# Altium project MB1272.PrjPcb (part 5 of 5)

## Sheet AUDIO.SchDoc: AUDIO
size A4; Project: STM32MP15-DISCO PI; Date: Not used; ApprovedBy: Not used; CheckedBy: Not used; Author: Not used; CompanyName: STMicroelectronics; DrawnBy: Not used; Engineer: Not used; Organization: Not used; Address1: Not used; Address2: Not used; Address3: Not used; Address4: Not used; DocumentNumber: 6; Revision: Not used; SheetNumber: 7; SheetTotal: 15; CurrentTime: Not used; CurrentDate: Not used; Time: Not used; DocumentFullPathAndName: Not used; DocumentName: Not used; ModifiedDate: Not used; ImagePath: Not used; ProjectName: Not used; Application_BuildNumber: Not used
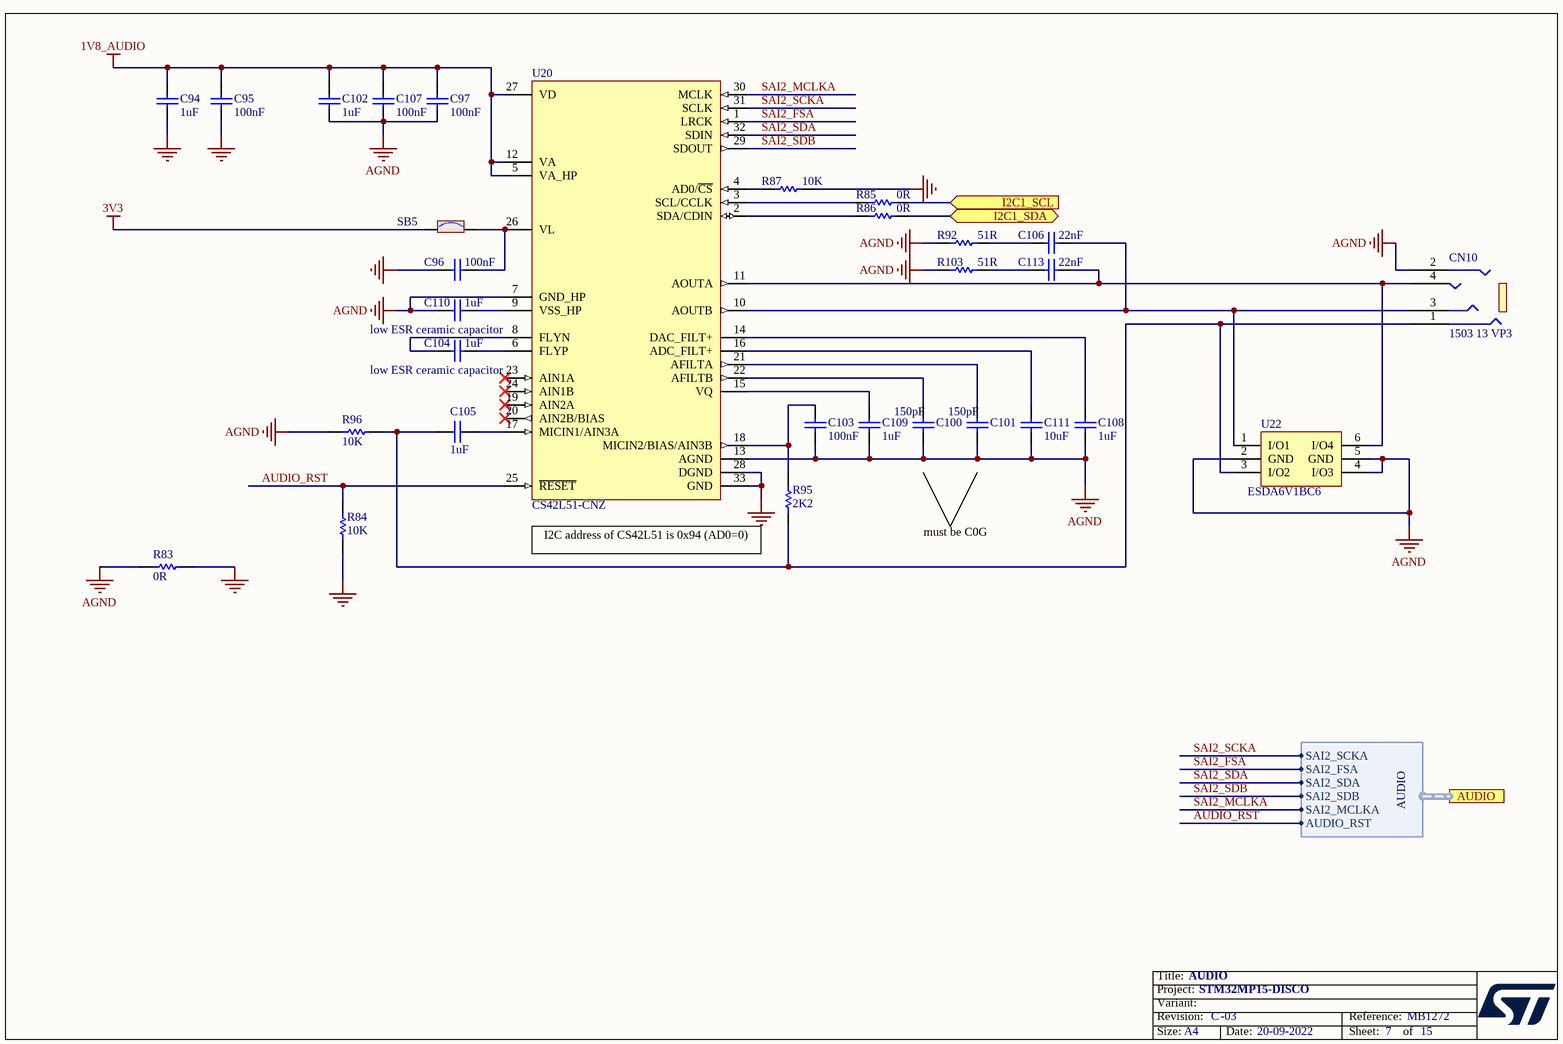
[diagram p13: AUDIO.SchDoc]

### Parts
C94  value 1uF  [C0402]
C95  value 100nF  [C0402]
C96  value 100nF  [C0402]
C97  value 100nF  [C0402]
C100  value 150pF  [C0603]
C101  value 150pF  [C0603]
C102  value 1uF  [C0402]
C103  value 100nF  [C0402]
C104  value 1uF  [C0603]
C105  value 1uF  [C0402]
C106  value 22nF  [C0402]
C107  value 100nF  [C0402]
C108  value 1uF  [C0402]
C109  value 1uF  [C0402]
C110  value 1uF  [C0603]
C111  value 10uF  [C0603]
C113  value 22nF  [C0402]
CN10  value 1503 13 VP3  [CON_JACK-3P5-SMT_LUMBERG_1503-13-VP3]
R83  value 0R  [R0603]
R84  value 10K  [R0402]
R85  value 0R  [R0402]
R86  value 0R  [R0402]
R87  value 10K  [R0402]
R92  value 51R  [R0402]
R95  value 2K2  [R0402]
R96  value 10K  [R0402]
R103  value 51R  [R0402]
SB5  (no value)  [SOLDER-BRIDGE_R0603-0R]
U20  value CS42L51-CNZ  [ICC_QFN32-EPAD_5X5_P050]
U22  value ESDA6V1BC6  [ESD_SOT23-6L]

### Ports
AUDIO (harness AUDIO), I2C1_SCL (in), I2C1_SDA (bidir)

### Harnesses
AUDIO: SAI2_SCKA, SAI2_FSA, SAI2_SDA, SAI2_SDB, SAI2_MCLKA, AUDIO_RST

### Nets
1V8_AUDIO: C94.2 C95.2 C97.2 C102.2 C107.2 U20.5(VA_HP) U20.12(VA) U20.27(VD)
3V3: SB5.1
AGND: C97.1 C100.1 C101.1 C102.1 C103.1 C107.1 C108.1 C109.1 C110.1 C111.1 CN10.2 R83.1 R92.1 R96.1 R103.1 U20.7(GND_HP) U20.13(AGND) U22.2(GND) U22.4(I/O3) U22.5(GND)
GND: C94.1 C95.1 C96.2 R83.2 R84.1 R87.2 U20.28(DGND) U20.33(GND)
AUDIO_RST: R84.2 U20.25(~{RESET}) ; port AUDIO.AUDIO_RST
I2C1_SCL: R85.2 ; port I2C1_SCL
I2C1_SDA: R86.2 ; port I2C1_SDA
SAI2_FSA: U20.1(LRCK) ; port AUDIO.SAI2_FSA
SAI2_MCLKA: U20.30(MCLK) ; port AUDIO.SAI2_MCLKA
SAI2_SCKA: U20.31(SCLK) ; port AUDIO.SAI2_SCKA
SAI2_SDA: U20.32(SDIN) ; port AUDIO.SAI2_SDA
SAI2_SDB: U20.29(SDOUT) ; port AUDIO.SAI2_SDB
NetC96_1: C96.1 SB5.2 U20.26(VL)
NetC100_2: C100.2 U20.22(AFILTB)
NetC101_2: C101.2 U20.21(AFILTA)
NetC103_2: C103.2 R95.2 U20.18(MICIN2/BIAS/AIN3B)
NetC104_1: C104.1 U20.8(FLYN)
NetC104_2: C104.2 U20.6(FLYP)
NetC105_1: C105.1 CN10.1 R95.1 R96.2 U22.3(I/O2)
NetC105_2: C105.2 U20.17(MICIN1/AIN3A)
NetC106_1: C106.1 R92.2
NetC106_2: C106.2 CN10.3 U20.10(AOUTB) U22.1(I/O1)
NetC108_2: C108.2 U20.14(DAC_FILT+)
NetC109_2: C109.2 U20.15(VQ)
NetC110_2: C110.2 U20.9(VSS_HP)
NetC111_2: C111.2 U20.16(ADC_FILT+)
NetC113_1: C113.1 R103.2
NetC113_2: C113.2 CN10.4 U20.11(AOUTA) U22.6(I/O4)
NetR85_1: R85.1 U20.3(SCL/CCLK)
NetR86_1: R86.1 U20.2(SDA/CDIN)
NetR87_1: R87.1 U20.4(AD0/~{CS})

Not connected (* = marked no-connect by the designer): U20 19(AIN2A)* 20(AIN2B/BIAS)* 23(AIN1A)* 24(AIN1B)*

### Notes on the sheet
- low ESR ceramic capacitor
- I2C address of CS42L51 is 0x94 (AD0=0)
- must be C0G
- Title:
- Project:
- Size:
- Revision:
- Variant:
- A4
- -
- Date:
- Reference:
- Sheet:
- of

### Library data of the parts
C94 C102 C105 C108 C109 = MCD-00095: Capacitor,1uF,6V3,X5R,10%,0402; Manufacturer_Part_Number: GRM155R61E105KA12; Manufacturer: MURATA; Alternate_Manufacturer_Part_Number: GRM155R60J105KE19; ECCN_US: EAR99; ECCN_EU: NEC; Provided_By: SUBCO; Initial_Board_Reference: mb1262; Internal_Part_Number: MCD-00095; ComponentLink1Description: Datasheet; Status: Released; Part_Type: Capacitor; Package: C0402; ComponentLink1URL: http://tunmcdsvn.tun.st.com/Component_Datasheet_Library/Trunk/Capacitors/Murata_Capacitor_GR_series; Alternate_Manufacturer: MURATA
C95-C97 C103 C107 = MCD-00006: Capacitor,100nF,16V,X7R,10%,0402; Manufacturer_Part_Number: CC0402KRX7R7BB104; Manufacturer: YAGEO; Alternate_Manufacturer: MURATA; Alternate_Manufacturer_Part_Number: GCM155R71C104KA55D; Provided_By: SUBCO; Initial_Board_Reference: mb1274; Internal_Part_Number: MCD-00006; ComponentLink1Description: Datasheet; ECCN_US: n/a; ECCN_EU: n/a; Status: Released; Part_Type: Capacitor; Package: C0402; ComponentLink1URL: http://tunmcdsvn.tun.st.com/Component_Datasheet_Library/Trunk/Capacitors/Yageo_Multilayer_Capacitor_X7R_series_100pF_to_22uF
C100 C101 = MCD-00304: Capacitor,150pF,50V,COG,5%,0603; Manufacturer_Part_Number: CC0603JRNPO9BN151; Manufacturer: YAGEO; Provided_By: SUBCO; Initial_Board_Reference: mb1263; Internal_Part_Number: MCD-00304; ComponentLink1Description: Datasheet; ECCN_US: n/a; ECCN_EU: n/a; Status: Released; Part_Type: Capacitor; Package: C0603; ComponentLink1URL: http://tunmcdsvn.tun.st.com/Component_Datasheet_Library/Trunk/Capacitors/Yageo_Capacitor_NP0_16V-to-50V
C104 C110 = MCD-00010: Capacitor,1uF,16V,X5R,10%,0603; Manufacturer_Part_Number: CC0603KRX5R7BB105; Manufacturer: YAGEO; Provided_By: SUBCO; Initial_Board_Reference: mb1274; Internal_Part_Number: MCD-00010; ComponentLink1Description: Datasheet; ECCN_US: n/a; ECCN_EU: n/a; Status: Released; Part_Type: Capacitor; Package: C0603; ComponentLink1URL: http://tunmcdsvn.tun.st.com/Component_Datasheet_Library/Trunk/Capacitors/Yageo_Multilayer_capacitor_X5R_series_100pF_to_100uF
C106 C113 = MCD-00202: Capacitor,22nF,16V,X7R,10%,0402; Manufacturer_Part_Number: CC0402KRX7R7BB223; Manufacturer: YAGEO; Provided_By: SUBCO; Internal_Part_Number: MCD-00202; Status: Checked; Part_Type: Capacitor; Package: C0402; ComponentLink1Description: Datasheet; ComponentLink1URL: http://tunmcdsvn.tun.st.com/Component_Datasheet_Library/Trunk/Capacitors/Yageo_Multilayer_Capacitor_X7R_series_100pF_to_22uF
C111 = MCD-00098: Capacitor,10uF,6V3,X5R,10%,0603; Manufacturer_Part_Number: CC0603KRX5R5BB106; Manufacturer: YAGEO; Provided_By: SUBCO; Initial_Board_Reference: mb1262; Internal_Part_Number: MCD-00098; ComponentLink1Description: Datasheet; Status: Released; Part_Type: Capacitor; Package: C0603; ECCN_US: n/a; ECCN_EU: n/a; ComponentLink1URL: http://tunmcdsvn.tun.st.com/Component_Datasheet_Library/Trunk/Capacitors/Yageo_Multilayer_capacitor_X5R_series_100pF_to_100uF
CN10 = MCD-00270: Connector Jack socket Stereo 3.5mm, 4 pins, RA, SMT, Black; Manufacturer: LUMBERG; Alternate_Manufacturer: FARNELL; Alternate_Manufacturer_Part_Number: 1368640; Provided_By: SUBCO; Initial_Board_Reference: MB1272; Internal_Part_Number: MCD-00270; Manufacturer_Part_Number: 1503 13 VP3; ComponentLink1Description: Datasheet; ComponentLink1URL: http://tunmcdsvn.tun.st.com/Component_Datasheet_Library/Trunk/Connectors/Lumberg_150313_Jack Connectors; Status: Checked; Part_Type: Connector
R83 = MCD-00056: Resistor,0R,0603,5%,1/10W; Manufacturer_Part_Number: RC0603JR-070RL; Manufacturer: YAGEO; Provided_By: SUBCO; Initial_Board_Reference: mb1274; Internal_Part_Number: MCD-00056; ComponentLink1Description: Datasheet; ECCN_US: n/a; ECCN_EU: n/a; Status: Released; Part_Type: Resistor; ComponentLink1URL: http://tunmcdsvn.tun.st.com/Component_Datasheet_Library/Trunk/Resistors/Yageo_Resistor_RC0603-series; Package: R0603
R84 R87 R96 = MCD-00053: Resistor,10K,0402,1%,1/16W; Manufacturer_Part_Number: RC0402FR-0710KL; Manufacturer: YAGEO; Provided_By: SUBCO; Initial_Board_Reference: mb1274; Internal_Part_Number: MCD-00053; ComponentLink1Description: Datasheet; ECCN_US: n/a; ECCN_EU: n/a; Status: Released; Part_Type: Resistor; ComponentLink1URL: http://tunmcdsvn.tun.st.com/Component_Datasheet_Library/Trunk/Resistors/Yageo_Resistor_RC0402-series; Package: R0402
R85 R86 = MCD-00052: Resistor,0R,0402,5%,1/16W; Manufacturer_Part_Number: RC0402JR-070RL; Manufacturer: YAGEO; Provided_By: SUBCO; Initial_Board_Reference: mb1274; Internal_Part_Number: MCD-00052; ComponentLink1Description: Datasheet; ECCN_US: n/a; ECCN_EU: n/a; Status: Released; Part_Type: Resistor; ComponentLink1URL: http://tunmcdsvn.tun.st.com/Component_Datasheet_Library/Trunk/Resistors/Yageo_Resistor_RC0402-series; Package: R0402
R92 R103 = MCD-00485: Resistor,51R,0402,1%,1/16W; Manufacturer_Part_Number: RC0402FR-0751RL; Manufacturer: YAGEO; Provided_By: SUBCO; Internal_Part_Number: MCD-00485; ComponentLink1Description: Datasheet; ECCN_US: n/a; ECCN_EU: n/a; Status: Released; Part_Type: Resistor; ComponentLink1URL: http://tunmcdsvn.tun.st.com/Component_Datasheet_Library/Trunk/Resistors/Yageo_Resistor_RC0402-series; Package: R0402
R95 = MCD-00057: Resistor,2K2,0402,1%,1/16W; Manufacturer_Part_Number: RC0402FR-072K2L; Manufacturer: YAGEO; Provided_By: SUBCO; Initial_Board_Reference: mb1274; Internal_Part_Number: MCD-00057; ComponentLink1Description: Datasheet; ECCN_US: n/a; ECCN_EU: n/a; Status: Released; Part_Type: Resistor; ComponentLink1URL: http://tunmcdsvn.tun.st.com/Component_Datasheet_Library/Trunk/Resistors/Yageo_Resistor_RC0402-series; Package: R0402
SB5 = MCD-00071: Solder Bridge ON; Part_Type: Mechanical; Manufacturer: YAGEO; Manufacturer_Part_Number: RC0603JR-070RL; Provided_By: SUBCO; Initial_Board_Reference: mb1274; Internal_Part_Number: MCD-00071; ECCN_US: n/a; ECCN_EU: n/a; Status: Released; ComponentLink1Description: Datasheet; ComponentLink1URL: http://tunmcdsvn.tun.st.com/Component_Datasheet_Library/Trunk/Resistors/Yageo_Resistor_RC0603-series; Package: SB0603
U20 = MCD-00265: Low-Power, Stereo Codec with Headphone Amp; Manufacturer: CIRRUS LOGIC; Part_Type: IC; Provided_By: SUBCO; ECCN_US: EAR99; ECCN_EU: NEC; Initial_Board_Reference: MB1272; Internal_Part_Number: MCD-00265; Manufacturer_Part_Number: CS42L51-CNZ; ComponentLink1Description: Datasheet; ComponentLink1URL: http://tunmcdsvn.tun.st.com/Component_Datasheet_Library/Trunk/IC/Cirrus Logic_CS42L51; Status: Released
U22 = MCD-00247: Quad Bidir ESD protection; Manufacturer: STMICROELECTRONICS; Part_Type: Diode; BMS_Part_Number: 9179038; Provided_By: SUBCO with ST control; ECCN_US: EAR99; ECCN_EU: NEC; Initial_Board_Reference: MB1311; Internal_Part_Number: MCD-00247; Manufacturer_Part_Number: ESDA6V1BC6; ComponentLink1Description: Datasheet; Status: Released; ComponentLink1URL: http://tunmcdsvn.tun.st.com/Component_Datasheet_Library/Trunk/Diodes/STM_ESD_ESDA6V1BC6

## Sheet DDR3_16bits.SchDoc: DDR3L_16bits
size A4; Project: STM32MP15-DISCO PI; PageSetup: Record=PageOptions|CenterHorizontal=True|CenterVertical=True|PrintScale=1.39|XCorrection=1.00|YCorrection=1.00|PrintKind=1|BorderSize=5000000|LeftOffset=0|BottomOffset=0|Orientation=2|PaperLength=1000|PaperWidth=1000|Scale=100|PaperSource=15|PrintQuality=600|MediaType=1|DitherType=10|PrintScaleMode=1|PaperKind=A3|PaperIndex=8; Date: Not used; ApprovedBy: Not used; CheckedBy: Not used; Author: Not used; CompanyName: STMicroelectronics; DrawnBy: Not used; Engineer: Not used; Organization: Not used; Address1: Not used; Address2: Not used; Address3: Not used; Address4: Not used; DocumentNumber: 11; Revision: Not used; SheetNumber: 11; SheetTotal: 15; CurrentTime: Not used; CurrentDate: Not used; Time: Not used; DocumentFullPathAndName: Not used; DocumentName: Not used; ModifiedDate: Not used; ImagePath: Not used; ProjectName: Not used; Application_BuildNumber: Not used
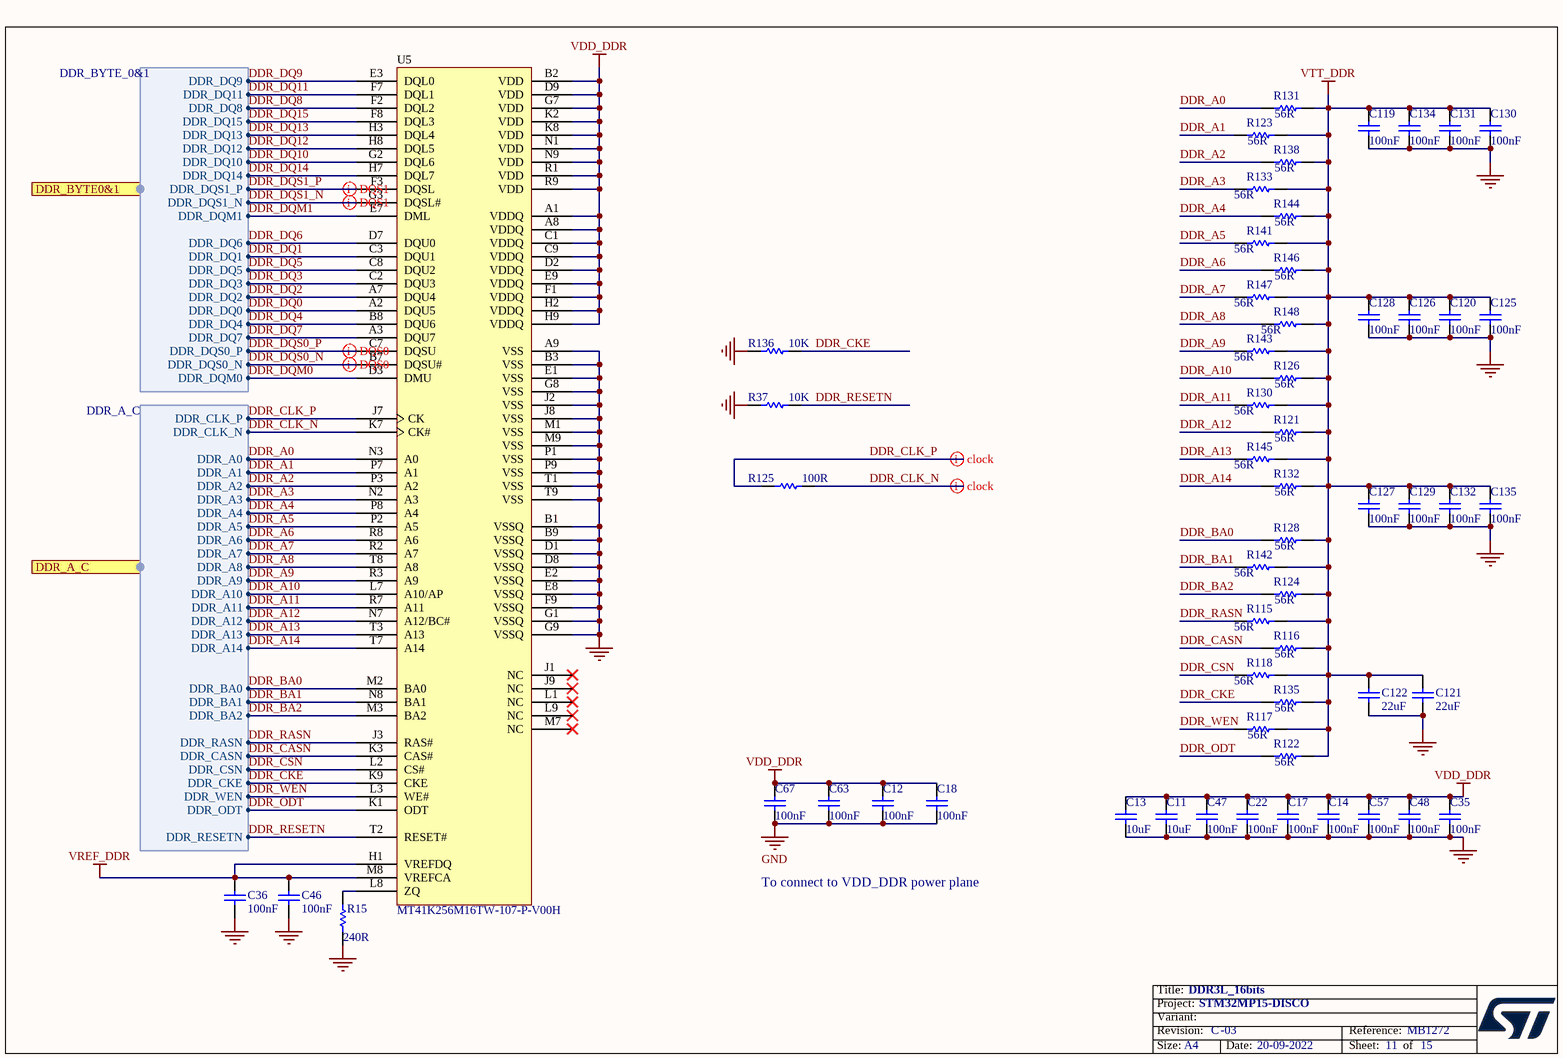
[diagram p14: DDR3_16bits.SchDoc]

### Parts
C11  value 10uF  [C0603]  (hidden comment: Capacitor)
C12  value 100nF  [C0402]  (hidden comment: Capacitor)
C13  value 10uF  [C0603]  (hidden comment: Capacitor)
C14  value 100nF  [C0402]
C17  value 100nF  [C0402]
C18  value 100nF  [C0402]  (hidden comment: Capacitor)
C22  value 100nF  [C0402]
C35  value 100nF  [C0402]
C36  value 100nF  [C0402]
C46  value 100nF  [C0402]
C47  value 100nF  [C0402]
C48  value 100nF  [C0402]
C57  value 100nF  [C0402]
C63  value 100nF  [C0402]  (hidden comment: Capacitor)
C67  value 100nF  [C0402]  (hidden comment: Capacitor)
C119  value 100nF  [C0402]
C120  value 100nF  [C0402]
C121  value 22uF  [C0603]
C122  value 22uF  [C0603]
C125  value 100nF  [C0402]
C126  value 100nF  [C0402]
C127  value 100nF  [C0402]
C128  value 100nF  [C0402]
C129  value 100nF  [C0402]
C130  value 100nF  [C0402]
C131  value 100nF  [C0402]
C132  value 100nF  [C0402]
C134  value 100nF  [C0402]
C135  value 100nF  [C0402]
R15  value 240R  [R0402]
R37  value 10K  [R0402]  (hidden comment: Resistor)
R115  value 56R  [R0402]  (hidden comment: Resistor)
R116  value 56R  [R0402]  (hidden comment: Resistor)
R117  value 56R  [R0402]  (hidden comment: Resistor)
R118  value 56R  [R0402]  (hidden comment: Resistor)
R121  value 56R  [R0402]  (hidden comment: Resistor)
R122  value 56R  [R0402]  (hidden comment: Resistor)
R123  value 56R  [R0402]  (hidden comment: Resistor)
R124  value 56R  [R0402]  (hidden comment: Resistor)
R125  value 100R  [R0402]  (hidden comment: Resistor)
R126  value 56R  [R0402]  (hidden comment: Resistor)
R128  value 56R  [R0402]  (hidden comment: Resistor)
R130  value 56R  [R0402]  (hidden comment: Resistor)
R131  value 56R  [R0402]  (hidden comment: Resistor)
R132  value 56R  [R0402]  (hidden comment: Resistor)
R133  value 56R  [R0402]  (hidden comment: Resistor)
R135  value 56R  [R0402]  (hidden comment: Resistor)
R136  value 10K  [R0402]  (hidden comment: Resistor)
R138  value 56R  [R0402]  (hidden comment: Resistor)
R141  value 56R  [R0402]  (hidden comment: Resistor)
R142  value 56R  [R0402]  (hidden comment: Resistor)
R143  value 56R  [R0402]  (hidden comment: Resistor)
R144  value 56R  [R0402]  (hidden comment: Resistor)
R145  value 56R  [R0402]  (hidden comment: Resistor)
R146  value 56R  [R0402]  (hidden comment: Resistor)
R147  value 56R  [R0402]  (hidden comment: Resistor)
R148  value 56R  [R0402]  (hidden comment: Resistor)
U5  value MT41K256M16TW-107-P-V00H  [ICC_FBGA96_8X14_P080]  (hidden comment: MT41K256M16TW-107:P - V00H)

### Ports
DDR_A_C (harness DDR_A_C), DDR_BYTE0&1 (harness DDR_BYTE_0&1)

### Harnesses
DDR_A_C: DDR_A4, DDR_A0, DDR_A2, DDR_A1, DDR_A6, DDR_A3, DDR_A5, DDR_A7, DDR_A8, DDR_A9, DDR_A14, DDR_A10, DDR_A12, DDR_A11, DDR_BA0, DDR_A13, DDR_BA1, DDR_BA2, DDR_RASN, DDR_CASN, DDR_CSN, DDR_CKE, DDR_WEN, DDR_ODT, DDR_CLK_P, DDR_CLK_N, DDR_RESETN
DDR_BYTE_0&1: DDR_DQ13, DDR_DQ9, DDR_DQ8, DDR_DQ11, DDR_DQ10, DDR_DQ15, DDR_DQ12, DDR_DQ14, DDR_DQS1_P, DDR_DQS1_N, DDR_DQ5, DDR_DQM1, DDR_DQ6, DDR_DQ2, DDR_DQ1, DDR_DQ3, DDR_DQ0, DDR_DQ4, DDR_DQ7, DDR_DQS0_P, DDR_DQS0_N, DDR_DQM0

### Nets
GND: C11.1 C12.1 C13.1 C14.2 C17.2 C18.1 C22.2 C35.2 C36.2 C46.2 C47.2 C48.2 C57.2 C63.1 C67.1 C119.2 C120.2 C121.1 C122.1 C125.2 C126.2 C127.2 C128.2 C129.2 C130.2 C131.2 C132.2 C134.2 C135.2 R15.1 R37.1 R136.1 U5.A9(VSS) U5.B1(VSSQ) U5.B3(VSS) U5.B9(VSSQ) U5.D1(VSSQ) U5.D8(VSSQ) U5.E1(VSS) U5.E2(VSSQ) U5.E8(VSSQ) U5.F9(VSSQ) U5.G1(VSSQ) U5.G8(VSS) U5.G9(VSSQ) U5.J2(VSS) U5.J8(VSS) U5.M1(VSS) U5.M9(VSS) U5.P1(VSS) U5.P9(VSS) U5.T1(VSS) U5.T9(VSS)
VDD_DDR: C11.2 C12.2 C13.2 C14.1 C17.1 C18.2 C22.1 C35.1 C47.1 C48.1 C57.1 C63.2 C67.2 U5.A1(VDDQ) U5.A8(VDDQ) U5.B2(VDD) U5.C1(VDDQ) U5.C9(VDDQ) U5.D2(VDDQ) U5.D9(VDD) U5.E9(VDDQ) U5.F1(VDDQ) U5.G7(VDD) U5.H2(VDDQ) U5.H9(VDDQ) U5.K2(VDD) U5.K8(VDD) U5.N1(VDD) U5.N9(VDD) U5.R1(VDD) U5.R9(VDD)
VREF_DDR: C36.1 C46.1 U5.H1(VREFDQ) U5.M8(VREFCA)
VTT_DDR: C119.1 C120.1 C121.2 C122.2 C125.1 C126.1 C127.1 C128.1 C129.1 C130.1 C131.1 C132.1 C134.1 C135.1 R115.2 R116.2 R117.2 R118.2 R121.2 R122.2 R123.2 R124.2 R126.2 R128.2 R130.2 R131.2 R132.2 R133.2 R135.2 R138.2 R141.2 R142.2 R143.2 R144.2 R145.2 R146.2 R147.2 R148.2
DDR_A0: R131.1 U5.N3(A0) ; port DDR_A_C.DDR_A0
DDR_A1: R123.1 U5.P7(A1) ; port DDR_A_C.DDR_A1
DDR_A2: R138.1 U5.P3(A2) ; port DDR_A_C.DDR_A2
DDR_A3: R133.1 U5.N2(A3) ; port DDR_A_C.DDR_A3
DDR_A4: R144.1 U5.P8(A4) ; port DDR_A_C.DDR_A4
DDR_A5: R141.1 U5.P2(A5) ; port DDR_A_C.DDR_A5
DDR_A6: R146.1 U5.R8(A6) ; port DDR_A_C.DDR_A6
DDR_A7: R147.1 U5.R2(A7) ; port DDR_A_C.DDR_A7
DDR_A8: R148.1 U5.T8(A8) ; port DDR_A_C.DDR_A8
DDR_A9: R143.1 U5.R3(A9) ; port DDR_A_C.DDR_A9
DDR_A10: R126.1 U5.L7(A10/AP) ; port DDR_A_C.DDR_A10
DDR_A11: R130.1 U5.R7(A11) ; port DDR_A_C.DDR_A11
DDR_A12: R121.1 U5.N7(A12/BC#) ; port DDR_A_C.DDR_A12
DDR_A13: R145.1 U5.T3(A13) ; port DDR_A_C.DDR_A13
DDR_A14: R132.1 U5.T7(A14) ; port DDR_A_C.DDR_A14
DDR_BA0: R128.1 U5.M2(BA0) ; port DDR_A_C.DDR_BA0
DDR_BA1: R142.1 U5.N8(BA1) ; port DDR_A_C.DDR_BA1
DDR_BA2: R124.1 U5.M3(BA2) ; port DDR_A_C.DDR_BA2
DDR_CASN: R116.1 U5.K3(CAS#) ; port DDR_A_C.DDR_CASN
DDR_CKE: R135.1 R136.2 U5.K9(CKE) ; port DDR_A_C.DDR_CKE
DDR_CLK_N: R125.2 U5.K7(CK#) ; port DDR_A_C.DDR_CLK_N
DDR_CLK_P: R125.1 U5.J7(CK) ; port DDR_A_C.DDR_CLK_P
DDR_CSN: R118.1 U5.L2(CS#) ; port DDR_A_C.DDR_CSN
DDR_DQ0: U5.A2(DQU5) ; port DDR_BYTE0&1.DDR_DQ0
DDR_DQ1: U5.C3(DQU1) ; port DDR_BYTE0&1.DDR_DQ1
DDR_DQ2: U5.A7(DQU4) ; port DDR_BYTE0&1.DDR_DQ2
DDR_DQ3: U5.C2(DQU3) ; port DDR_BYTE0&1.DDR_DQ3
DDR_DQ4: U5.B8(DQU6) ; port DDR_BYTE0&1.DDR_DQ4
DDR_DQ5: U5.C8(DQU2) ; port DDR_BYTE0&1.DDR_DQ5
DDR_DQ6: U5.D7(DQU0) ; port DDR_BYTE0&1.DDR_DQ6
DDR_DQ7: U5.A3(DQU7) ; port DDR_BYTE0&1.DDR_DQ7
DDR_DQ8: U5.F2(DQL2) ; port DDR_BYTE0&1.DDR_DQ8
DDR_DQ9: U5.E3(DQL0) ; port DDR_BYTE0&1.DDR_DQ9
DDR_DQ10: U5.G2(DQL6) ; port DDR_BYTE0&1.DDR_DQ10
DDR_DQ11: U5.F7(DQL1) ; port DDR_BYTE0&1.DDR_DQ11
DDR_DQ12: U5.H8(DQL5) ; port DDR_BYTE0&1.DDR_DQ12
DDR_DQ13: U5.H3(DQL4) ; port DDR_BYTE0&1.DDR_DQ13
DDR_DQ14: U5.H7(DQL7) ; port DDR_BYTE0&1.DDR_DQ14
DDR_DQ15: U5.F8(DQL3) ; port DDR_BYTE0&1.DDR_DQ15
DDR_DQM0: U5.D3(DMU) ; port DDR_BYTE0&1.DDR_DQM0
DDR_DQM1: U5.E7(DML) ; port DDR_BYTE0&1.DDR_DQM1
DDR_DQS0_N: U5.B7(DQSU#) ; port DDR_BYTE0&1.DDR_DQS0_N
DDR_DQS0_P: U5.C7(DQSU) ; port DDR_BYTE0&1.DDR_DQS0_P
DDR_DQS1_N: U5.G3(DQSL#) ; port DDR_BYTE0&1.DDR_DQS1_N
DDR_DQS1_P: U5.F3(DQSL) ; port DDR_BYTE0&1.DDR_DQS1_P
DDR_ODT: R122.1 U5.K1(ODT) ; port DDR_A_C.DDR_ODT
DDR_RASN: R115.1 U5.J3(RAS#) ; port DDR_A_C.DDR_RASN
DDR_RESETN: R37.2 U5.T2(RESET#) ; port DDR_A_C.DDR_RESETN
DDR_WEN: R117.1 U5.L3(WE#) ; port DDR_A_C.DDR_WEN
NetR15_2: R15.2 U5.L8(ZQ)

Not connected (* = marked no-connect by the designer): U5 J1(NC)* J9(NC)* L1(NC)* L9(NC)* M7(NC)*

### Layout directives
differential pair: DDR_CLK_N, DDR_CLK_P, DDR_DQS0_N, DDR_DQS0_P, DDR_DQS1_N, DDR_DQS1_P

### Notes on the sheet
- To connect to VDD_DDR power plane
- Title:
- Project:
- Size:
- Revision:
- Variant:
- A4
- -
- Date:
- Reference:
- Sheet:
- of

### Library data of the parts
C11 C13 = MCD-00099: Capacitor, MLCC, 10uF, 10V, X5R, 10%, 0603, T=0,8mm; Manufacturer_Part_Number: GRM188R61A106KE69D; Manufacturer: MURATA; ECCN_US: EAR99; ECCN_EU: NEC; Provided_By: SUBCO; Initial_Board_Reference: MB1262; Internal_Part_Number: MCD-00099; Status: Released; Part_Type: Capacitor; Package: C0603; ComponentLink1Description: Datasheet; ComponentLink1URL: http://tunmcdsvn.tun.st.com/Component_Datasheet_Library/Trunk/Capacitors/Murata_Capacitor_GR_series
C12 C18 C63 C67 = MCD-00006: Capacitor, MLCC, 100nF, 16V, X7R, 10%, 0402, T=0.5mm; Manufacturer_Part_Number: CC0402KRX7R7BB104; Manufacturer: YAGEO; Alternate_Manufacturer: MURATA; Alternate_Manufacturer_Part_Number: GCM155R71C104KA55D; Provided_By: SUBCO; Initial_Board_Reference: MB1274; Internal_Part_Number: MCD-00006; Status: Released; Part_Type: Capacitor; Package: C0402; ComponentLink1Description: Datasheet; ComponentLink1URL: http://tunmcdsvn.tun.st.com/Component_Datasheet_Library/Trunk/Capacitors/Yageo_Multilayer_Capacitor_X7R_series_100pF_to_22uF; ECCN_US: n/a; ECCN_EU: n/a
C14 C17 C22 C35 C36 C46-C48 C57 C119 C120 C125-C132 C134 C135 = MCD-00006: as C95-C97 on sheet AUDIO; Internal_Part_Number: MCD-00006; ComponentLink1Description: Datasheet; ECCN_US: n/a; ECCN_EU: n/a; Status: Released; Part_Type: Capacitor; Package: C0402; ComponentLink1URL: http://tunmcdsvn.tun.st.com/Component_Datasheet_Library/Trunk/Capacitors/Yageo_Multilayer_Capacitor_X7R_series_100pF_to_22uF
C121 C122 = MCD-00100: Capacitor, MLCC, 22uF, 6V3, X5R, 20%, 0603, T=0,8mm; Manufacturer_Part_Number: GRM188R60J226MEA0J; Manufacturer: MURATA; ECCN_US: EAR99; ECCN_EU: NEC; Provided_By: SUBCO; Initial_Board_Reference: mb1262; Internal_Part_Number: MCD-00100; Status: Released; Part_Type: Capacitor; Package: C0603; ComponentLink1Description: Datasheet; ComponentLink1URL: http://tunmcdsvn.tun.st.com/Component_Datasheet_Library/Trunk/Capacitors/Murata_Capacitor_GR_series
R15 = MCD-00120: Resistor,240R,0402,1%,1/16W; Manufacturer_Part_Number: RC0402FR-07240RL; Manufacturer: YAGEO; Provided_By: SUBCO; Initial_Board_Reference: mb1262; Internal_Part_Number: MCD-00120; ComponentLink1Description: Datasheet; Status: Released; Part_Type: Resistor; ECCN_US: n/a; ECCN_EU: n/a; ComponentLink1URL: http://tunmcdsvn.tun.st.com/Component_Datasheet_Library/Trunk/Resistors/Yageo_Resistor_RC0402-series; Package: R0402
R37 R136 = MCD-00053: Resistor,10K,0402,1%,1/16W; Manufacturer_Part_Number: RC0402FR-0710KL; Manufacturer: YAGEO; Provided_By: SUBCO; Initial_Board_Reference: MB1274; Internal_Part_Number: MCD-00053; Status: Released; Part_Type: Resistor; Package: R0402; ComponentLink1Description: Datasheet; ComponentLink1URL: http://tunmcdsvn.tun.st.com/Component_Datasheet_Library/Trunk/Resistors/Yageo_Resistor_RC0402-series; ECCN_US: n/a; ECCN_EU: n/a
R115-R118 R121-R124 R126 R128 R130-R133 R135 R138 R141-R148 = MCD-00054: Resistor, 56R, 0402, +/-1%, 1/16W; Manufacturer_Part_Number: RC0402FR-0756RL; Manufacturer: YAGEO; Part_Preference: Recommended; Component_Country_Of_Origin: China; ShowFields: YES; ID: 2538; Internal_Part_Number: MCD-00054; Status: Released; Part_Type: Resistor; ComponentLink1URL: http://tunmcdsvn.tun.st.com/Component_Documentation_Library/Trunk/Resistor/YAGEO_RC_L_Series; Package: 0402; Order_Code_Digikey: 311-56.0LRCT-ND; Order_Code_Farnell: 9239081; Order_Code_RS: N/A
R125 = MCD-00067: Resistor,100R,0402,1%,1/16W; Manufacturer_Part_Number: RC0402FR-07100RL; Manufacturer: YAGEO; Provided_By: SUBCO; Initial_Board_Reference: MB1274; Internal_Part_Number: MCD-00067; Status: Released; Part_Type: Resistor; Package: R0402; ComponentLink1Description: Datasheet; ComponentLink1URL: http://tunmcdsvn.tun.st.com/Component_Datasheet_Library/Trunk/Resistors/Yageo_Resistor_RC0402-series; ECCN_US: n/a; ECCN_EU: n/a
U5 = MCD-00207: Memory,DDR3L,4Gb,256Mbx16,1866MT/s,1V35,FBGA96; Part_Type: IC; Manufacturer: MICRON; Provided_By: SUBCO; Initial_Board_Reference: MB1263; Internal_Part_Number: MCD-00207; Status: Released; Manufacturer_Part_Number: MT41K256M16TW-107-P-V00H; ComponentLink1Description: Datasheet; ComponentLink1URL: http://tunmcdsvn.tun.st.com/Component_Datasheet_Library/Trunk/IC/Micron_4Gb_DDR3L_MT41K256M16TW-107P-V00H; ECCN_US: n/a; ECCN_EU: n/a

## Nets that join several sheets
1V2_HDMI: Power_PMIC (C31.2 U4.21), HDMI (5 pins)
1V8_AUDIO: Power_PMIC (C33.2 U4.23), AUDIO (8 pins)
3V3: Power_PMIC (5 pins), MPU_12x12 (6 pins), Peripherals (10 pins), ST_LINK_V2-1 (R94.1), GPIO_&_Arduino_ Connectors (5 pins), DSI_LCD (L7.1 R11.1), WLAN_BLUETOOTH (10 pins), Ethernet (L10.2 L11.2), USB_Host_Hub&TypeC_DRP (18 pins), AUDIO (SB5.1)
3V3_HDMI: Power_PMIC (C20.2 U4.18), HDMI (R154.2)
5V_VIN: Power_PMIC (20 pins), ST_LINK_V2-1 (D1.1), GPIO_&_Arduino_ Connectors (CN2.2 CN2.4 R165.1 U23.1), HDMI (F1.1 R97.2 R98.2), USB_Host_Hub&TypeC_DRP (9 pins)
GND: Power_PMIC (51 pins), Power_MPU (85 pins), MPU_12x12 (15 pins), Peripherals (16 pins), ST_LINK_V2-1 (35 pins), GPIO_&_Arduino_ Connectors (15 pins), DSI_LCD (12 pins), WLAN_BLUETOOTH (22 pins), Ethernet (33 pins), HDMI (36 pins), USB_Host_Hub&TypeC_DRP (76 pins), AUDIO (8 pins), DDR3_16bits (53 pins)
VDD: Power_PMIC (C44.2 L6.2 U4.31 U4.42), Power_MPU (16 pins), MPU_12x12 (5 pins), Peripherals (R101.2 R102.2 R109.2)
VDD_CORE: Power_PMIC (LNK2.2 R3.2), Power_MPU (28 pins)
VDD_DDR: Power_PMIC (5 pins), Power_MPU (14 pins), DDR3_16bits (31 pins)
VDD_USB: Power_PMIC (C16.2 U4.39), Power_MPU (C139.2 U13.AA15 U13.AA17)
VDDA: Power_PMIC (C32.2 U4.20), Power_MPU (R78.1)
VREF+: Power_MPU (C165.2 R74.2 U13.R4), GPIO_&_Arduino_ Connectors (C1.2 R4.2)
VREF_DDR: Power_PMIC (C15.2 U4.16), MPU_12x12 (C68.2 U13.AC20), DDR3_16bits (C36.1 C46.1 U5.H1 U5.M8)
VTT_DDR: Power_PMIC (C9.2 U4.14), DDR3_16bits (38 pins)
ARD_A0: MPU_12x12 (U13.AC4), GPIO_&_Arduino_ Connectors (CN17.1)
ARD_A1: MPU_12x12 (U13.Y5), GPIO_&_Arduino_ Connectors (CN17.2)
ARD_A2: MPU_12x12 (U13.U3), GPIO_&_Arduino_ Connectors (CN17.3)
ARD_A3: MPU_12x12 (U13.U4), GPIO_&_Arduino_ Connectors (CN17.4)
ARD_A4: MPU_12x12 (U13.W2), GPIO_&_Arduino_ Connectors (SB24.1)
ARD_A5: MPU_12x12 (U13.Y9), GPIO_&_Arduino_ Connectors (SB26.1)
ARD_D0: MPU_12x12 (U13.AA11), GPIO_&_Arduino_ Connectors (CN14.1)
ARD_D1: MPU_12x12 (U13.AC13), GPIO_&_Arduino_ Connectors (CN14.2)
ARD_D2: MPU_12x12 (U13.C8), GPIO_&_Arduino_ Connectors (CN14.3)
ARD_D3: MPU_12x12 (U13.L3), GPIO_&_Arduino_ Connectors (CN14.4)
ARD_D4: MPU_12x12 (U13.Y15), GPIO_&_Arduino_ Connectors (CN14.5)
ARD_D5: MPU_12x12 (U13.J2), GPIO_&_Arduino_ Connectors (CN14.6)
ARD_D6: MPU_12x12 (U13.AA9), GPIO_&_Arduino_ Connectors (CN14.7)
ARD_D7: MPU_12x12 (U13.B9), GPIO_&_Arduino_ Connectors (CN14.8)
ARD_D8: MPU_12x12 (U13.T4), GPIO_&_Arduino_ Connectors (CN13.1)
ARD_D9: MPU_12x12 (U13.Y11), GPIO_&_Arduino_ Connectors (CN13.2)
ARD_D10: MPU_12x12 (U13.A4), GPIO_&_Arduino_ Connectors (CN13.3)
ARD_D11: MPU_12x12 (U13.C6), GPIO_&_Arduino_ Connectors (CN13.4)
ARD_D12: MPU_12x12 (U13.A3), GPIO_&_Arduino_ Connectors (CN13.5)
ARD_D13: MPU_12x12 (U13.B4), GPIO_&_Arduino_ Connectors (CN13.6 SB6.1)
ARD_D14: MPU_12x12 (R166.2 U13.AB19), GPIO_&_Arduino_ Connectors (CN2.3 CN13.9 SB23.1)
ARD_D15: MPU_12x12 (R167.2 U13.AA18), GPIO_&_Arduino_ Connectors (CN2.5 CN13.10 SB25.1)
AUDIO_RST: MPU_12x12 (U13.Y13), AUDIO (R84.2 U20.25)
BOOT0: MPU_12x12 (U13.N1), Peripherals (SW1.1)
BOOT1: MPU_12x12 (U13.N4), Peripherals (R82.2)
BOOT2: MPU_12x12 (U13.M2), Peripherals (SW1.2)
BT_DEV_WAKE: MPU_12x12 (U13.J3), WLAN_BLUETOOTH (U8.39)
BT_HOST_WAKE: MPU_12x12 (U13.A2), WLAN_BLUETOOTH (U8.38)
BT_PCM_CLK: MPU_12x12 (U13.G3), WLAN_BLUETOOTH (U8.11)
BT_PCM_SDI: MPU_12x12 (U13.G1), WLAN_BLUETOOTH (U8.10)
BT_PCM_SDO: MPU_12x12 (U13.J4), WLAN_BLUETOOTH (U8.9)
BT_PCM_WS: MPU_12x12 (U13.G4), WLAN_BLUETOOTH (U8.8)
BT_REG_ON: MPU_12x12 (U13.H1), WLAN_BLUETOOTH (TP29.1 U8.14)
DDR_A0: MPU_12x12 (U13.L20), DDR3_16bits (R131.1 U5.N3)
DDR_A1: MPU_12x12 (U13.P22), DDR3_16bits (R123.1 U5.P7)
DDR_A2: MPU_12x12 (U13.J20), DDR3_16bits (R138.1 U5.P3)
DDR_A3: MPU_12x12 (U13.K22), DDR3_16bits (R133.1 U5.N2)
DDR_A4: MPU_12x12 (U13.V20), DDR3_16bits (R144.1 U5.P8)
DDR_A5: MPU_12x12 (U13.H20), DDR3_16bits (R141.1 U5.P2)
DDR_A6: MPU_12x12 (U13.W20), DDR3_16bits (R146.1 U5.R8)
DDR_A7: MPU_12x12 (U13.E20), DDR3_16bits (R147.1 U5.R2)
DDR_A8: MPU_12x12 (U13.Y20), DDR3_16bits (R148.1 U5.T8)
DDR_A9: MPU_12x12 (U13.G20), DDR3_16bits (R143.1 U5.R3)
DDR_A10: MPU_12x12 (U13.R22), DDR3_16bits (R126.1 U5.L7)
DDR_A11: MPU_12x12 (U13.R20), DDR3_16bits (R130.1 U5.R7)
DDR_A12: MPU_12x12 (U13.P23), DDR3_16bits (R121.1 U5.N7)
DDR_A13: MPU_12x12 (U13.F20), DDR3_16bits (R145.1 U5.T3)
DDR_A14: MPU_12x12 (U13.R21), DDR3_16bits (R132.1 U5.T7)
DDR_BA0: MPU_12x12 (U13.L23), DDR3_16bits (R128.1 U5.M2)
DDR_BA1: MPU_12x12 (U13.U20), DDR3_16bits (R142.1 U5.N8)
DDR_BA2: MPU_12x12 (U13.M21), DDR3_16bits (R124.1 U5.M3)
DDR_CASN: MPU_12x12 (U13.N20), DDR3_16bits (R116.1 U5.K3)
DDR_CKE: MPU_12x12 (U13.T20), DDR3_16bits (R135.1 R136.2 U5.K9)
DDR_CLK_N: MPU_12x12 (U13.N23), DDR3_16bits (R125.2 U5.K7)
DDR_CLK_P: MPU_12x12 (U13.N22), DDR3_16bits (R125.1 U5.J7)
DDR_CSN: MPU_12x12 (U13.M22), DDR3_16bits (R118.1 U5.L2)
DDR_DQ0: MPU_12x12 (U13.E22), DDR3_16bits (U5.A2)
DDR_DQ1: MPU_12x12 (U13.F22), DDR3_16bits (U5.C3)
DDR_DQ2: MPU_12x12 (U13.H21), DDR3_16bits (U5.A7)
DDR_DQ3: MPU_12x12 (U13.E21), DDR3_16bits (U5.C2)
DDR_DQ4: MPU_12x12 (U13.J21), DDR3_16bits (U5.B8)
DDR_DQ5: MPU_12x12 (U13.J22), DDR3_16bits (U5.C8)
DDR_DQ6: MPU_12x12 (U13.H22), DDR3_16bits (U5.D7)
DDR_DQ7: MPU_12x12 (U13.G21), DDR3_16bits (U5.A3)
DDR_DQ8: MPU_12x12 (U13.T21), DDR3_16bits (U5.F2)
DDR_DQ9: MPU_12x12 (U13.U21), DDR3_16bits (U5.E3)
DDR_DQ10: MPU_12x12 (U13.T22), DDR3_16bits (U5.G2)
DDR_DQ11: MPU_12x12 (U13.W21), DDR3_16bits (U5.F7)
DDR_DQ12: MPU_12x12 (U13.W23), DDR3_16bits (U5.H8)
DDR_DQ13: MPU_12x12 (U13.T23), DDR3_16bits (U5.H3)
DDR_DQ14: MPU_12x12 (U13.W22), DDR3_16bits (U5.H7)
DDR_DQ15: MPU_12x12 (U13.Y21), DDR3_16bits (U5.F8)
DDR_DQM0: MPU_12x12 (U13.H23), DDR3_16bits (U5.D3)
DDR_DQM1: MPU_12x12 (U13.V22), DDR3_16bits (U5.E7)
DDR_DQS0_N: MPU_12x12 (U13.G23), DDR3_16bits (U5.B7)
DDR_DQS0_P: MPU_12x12 (U13.G22), DDR3_16bits (U5.C7)
DDR_DQS1_N: MPU_12x12 (U13.U23), DDR3_16bits (U5.G3)
DDR_DQS1_P: MPU_12x12 (U13.U22), DDR3_16bits (U5.F3)
DDR_ODT: MPU_12x12 (U13.L22), DDR3_16bits (R122.1 U5.K1)
DDR_RASN: MPU_12x12 (U13.N21), DDR3_16bits (R115.1 U5.J3)
DDR_RESETN: MPU_12x12 (U13.D20), DDR3_16bits (R37.2 U5.T2)
DDR_WEN: MPU_12x12 (U13.M20), DDR3_16bits (R117.1 U5.L3)
DSI_CK_N: MPU_12x12 (U13.A16), DSI_LCD (CN4.5)
DSI_CK_P: MPU_12x12 (U13.B16), DSI_LCD (CN4.6)
DSI_D0_N: MPU_12x12 (U13.B15), DSI_LCD (CN4.8)
DSI_D0_P: MPU_12x12 (U13.C15), DSI_LCD (CN4.9)
DSI_D1_N: MPU_12x12 (U13.A17), DSI_LCD (CN4.2)
DSI_D1_P: MPU_12x12 (U13.B17), DSI_LCD (CN4.3)
DSI_LCD_BL_CTRL: MPU_12x12 (U13.C19), DSI_LCD (CN4.19)
DSI_LCD_INT: MPU_12x12 (U13.A14), DSI_LCD (CN4.17)
DSI_RESET: MPU_12x12 (U13.D19), DSI_LCD (CN4.20 R11.2)
DSI_TE: MPU_12x12 (U13.B14), DSI_LCD (CN4.18)
ETH_CLK: MPU_12x12 (U13.Y8), Ethernet (R69.2)
ETH_CLK125: MPU_12x12 (U13.Y6), Ethernet (R153.1)
ETH_GTX_CLK: MPU_12x12 (U13.AB2), Ethernet (U18.20)
ETH_MDC: MPU_12x12 (U13.AA6), Ethernet (R76.1 U18.13)
ETH_MDINT: MPU_12x12 (U13.AC8), Ethernet (R65.1 U18.31)
ETH_MDIO: MPU_12x12 (U13.AC3), Ethernet (R75.1 U18.14)
ETH_NRST: MPU_12x12 (R300.2 U13.AC2), Ethernet (U18.12)
ETH_RX_CLK: MPU_12x12 (U13.AA4), Ethernet (R50.2 R58.1)
ETH_RX_DV: MPU_12x12 (U13.AB8), Ethernet (R51.2 R59.1)
ETH_RXD0: MPU_12x12 (U13.AC7), Ethernet (R52.1 R60.1)
ETH_RXD1: MPU_12x12 (U13.AB7), Ethernet (R53.1 R61.1)
ETH_RXD2: MPU_12x12 (U13.AB6), Ethernet (R54.2 R62.1)
ETH_RXD3: MPU_12x12 (U13.AA7), Ethernet (R55.1 R63.1)
ETH_TX_EN: MPU_12x12 (U13.AB1), Ethernet (U18.19)
ETH_TXD0: MPU_12x12 (U13.AA2), Ethernet (U18.18)
ETH_TXD1: MPU_12x12 (U13.AA1), Ethernet (U18.17)
ETH_TXD2: MPU_12x12 (U13.Y2), Ethernet (U18.16)
ETH_TXD3: MPU_12x12 (U13.Y1), Ethernet (U18.15)
EXP_GPIO4: MPU_12x12 (TP19.1 U13.A13), GPIO_&_Arduino_ Connectors (CN2.7)
EXP_GPIO5: MPU_12x12 (TP1.1 U13.V2), GPIO_&_Arduino_ Connectors (CN2.29)
EXP_GPIO6: MPU_12x12 (U13.C4), GPIO_&_Arduino_ Connectors (CN2.31)
EXP_GPIO7: MPU_12x12 (U13.U1), GPIO_&_Arduino_ Connectors (CN2.26)
EXP_GPIO8: MPU_12x12 (U13.AA13), GPIO_&_Arduino_ Connectors (CN2.24)
EXP_GPIO9: MPU_12x12 (U13.AC11), GPIO_&_Arduino_ Connectors (CN2.21)
EXP_GPIO10: MPU_12x12 (U13.AA14), GPIO_&_Arduino_ Connectors (CN2.19)
EXP_GPIO11: MPU_12x12 (U13.AB12), GPIO_&_Arduino_ Connectors (CN2.23)
EXP_GPIO12: MPU_12x12 (U13.AA19), GPIO_&_Arduino_ Connectors (CN2.32)
EXP_GPIO13: MPU_12x12 (U13.B11), GPIO_&_Arduino_ Connectors (CN2.33)
EXP_GPIO14: MPU_12x12 (U13.Y3), GPIO_&_Arduino_ Connectors (CN2.8)
EXP_GPIO15: MPU_12x12 (U13.AC5), GPIO_&_Arduino_ Connectors (CN2.10)
EXP_GPIO16: MPU_12x12 (U13.AA10), GPIO_&_Arduino_ Connectors (CN2.36)
EXP_GPIO17: MPU_12x12 (U13.AB9), GPIO_&_Arduino_ Connectors (CN2.11)
EXP_GPIO18: MPU_12x12 (SB14.1), GPIO_&_Arduino_ Connectors (CN2.12)
EXP_GPIO19: MPU_12x12 (SB16.1), GPIO_&_Arduino_ Connectors (CN2.35)
EXP_GPIO20: MPU_12x12 (SB15.1), GPIO_&_Arduino_ Connectors (CN2.38)
EXP_GPIO21: MPU_12x12 (SB13.1), GPIO_&_Arduino_ Connectors (CN2.40)
EXP_GPIO22: MPU_12x12 (U13.B7), GPIO_&_Arduino_ Connectors (CN2.15)
EXP_GPIO23: MPU_12x12 (U13.A5), GPIO_&_Arduino_ Connectors (CN2.16)
EXP_GPIO24: MPU_12x12 (U13.D8), GPIO_&_Arduino_ Connectors (CN2.18)
EXP_GPIO25: MPU_12x12 (U13.D9), GPIO_&_Arduino_ Connectors (CN2.22)
EXP_GPIO26: MPU_12x12 (U13.D7), GPIO_&_Arduino_ Connectors (CN2.37)
EXP_GPIO27: MPU_12x12 (U13.D10), GPIO_&_Arduino_ Connectors (CN2.13)
HDMI_CEC: MPU_12x12 (U13.Y14), HDMI (U14.50)
HDMI_INT: MPU_12x12 (U13.W1), HDMI (U14.52)
HDMI_NRST: MPU_12x12 (R40.2 U13.Y17), HDMI (U14.51)
I2C1_SCL: MPU_12x12 (R1.2 U13.Y18), GPIO_&_Arduino_ Connectors (CN2.28), DSI_LCD (CN4.11), HDMI (U14.1), USB_Host_Hub&TypeC_DRP (SB8.1), AUDIO (R85.2)
I2C1_SDA: MPU_12x12 (R2.2 U13.Y4), GPIO_&_Arduino_ Connectors (CN2.27), DSI_LCD (CN4.12), HDMI (U14.2), USB_Host_Hub&TypeC_DRP (SB7.1), AUDIO (R86.2)
I2C4_SCL: Power_PMIC (U4.4), MPU_12x12 (R5.2 U13.G2), USB_Host_Hub&TypeC_DRP (U12.7)
I2C4_SDA: Power_PMIC (U4.3), MPU_12x12 (R7.2 U13.H2), USB_Host_Hub&TypeC_DRP (U12.8)
I2S2_CK: MPU_12x12 (U13.A8), HDMI (U14.45)
I2S2_SDO: MPU_12x12 (U13.E1), HDMI (U14.41)
I2S2_WS: MPU_12x12 (U13.B10), HDMI (U14.44)
JTDO_TRACESWO: MPU_12x12 (TP8.1 U13.A19), ST_LINK_V2-1 (SB19.2)
LED_B: MPU_12x12 (U13.AC10), Peripherals (R108.1)
LED_Y: MPU_12x12 (U13.W4), Peripherals (R107.1)
LPO_32: MPU_12x12 (U13.L4), WLAN_BLUETOOTH (TP26.1 U8.37)
LTDC_B0: MPU_12x12 (U13.K1), HDMI (U14.32)
LTDC_B1: MPU_12x12 (U13.K4), HDMI (U14.31)
LTDC_B2: MPU_12x12 (U13.AB11), HDMI (U14.30)
LTDC_B3: MPU_12x12 (U13.B5), HDMI (U14.29)
LTDC_B4: MPU_12x12 (U13.E4), HDMI (U14.28)
LTDC_B5: MPU_12x12 (U13.U2), HDMI (U14.27)
LTDC_B6: MPU_12x12 (U13.AB10), HDMI (U14.25)
LTDC_B7: MPU_12x12 (U13.K3), HDMI (U14.24)
LTDC_CLK: MPU_12x12 (U13.AC14), HDMI (U14.22)
LTDC_DE: MPU_12x12 (U13.Y12), HDMI (U14.33)
LTDC_G0: MPU_12x12 (U13.C11), HDMI (U14.23)
LTDC_G1: MPU_12x12 (U13.C10), HDMI (U14.20)
LTDC_G2: MPU_12x12 (U13.D1), HDMI (U14.19)
LTDC_G3: MPU_12x12 (U13.C3), HDMI (U14.18)
LTDC_G4: MPU_12x12 (U13.B1), HDMI (U14.17)
LTDC_G5: MPU_12x12 (U13.C1), HDMI (U14.16)
LTDC_G6: MPU_12x12 (U13.E3), HDMI (U14.15)
LTDC_G7: MPU_12x12 (U13.E2), HDMI (U14.14)
LTDC_HSYNC: MPU_12x12 (U13.T1), HDMI (U14.34)
LTDC_R0: MPU_12x12 (U13.AB4), HDMI (U14.13)
LTDC_R1: MPU_12x12 (U13.AA3), HDMI (U14.11)
LTDC_R2: MPU_12x12 (U13.D5), HDMI (U14.10)
LTDC_R3: MPU_12x12 (U13.C5), HDMI (U14.9)
LTDC_R4: MPU_12x12 (U13.C2), HDMI (U14.8)
LTDC_R5: MPU_12x12 (U13.AB5), HDMI (U14.7)
LTDC_R6: MPU_12x12 (U13.B2), HDMI (U14.6)
LTDC_R7: MPU_12x12 (U13.D3), HDMI (U14.4)
LTDC_VSYNC: MPU_12x12 (U13.H4), HDMI (U14.35)
NRST: Power_PMIC (R6.1), MPU_12x12 (U13.M3), Peripherals (5 pins), ST_LINK_V2-1 (SB22.2), GPIO_&_Arduino_ Connectors (CN16.3)
PA0_WKUP: Power_PMIC (U4.43), MPU_12x12 (U13.AB3)
PA13: MPU_12x12 (U13.N2), Peripherals (B4.1 B4.2 LD6.2)
PA14: MPU_12x12 (U13.T2), Peripherals (B3.1 B3.2 LD5.2)
PMIC_WAKEUP: Power_PMIC (U4.2), MPU_12x12 (U13.K2)
SAI2_FSA: MPU_12x12 (SB1.1), AUDIO (U20.1)
SAI2_MCLKA: MPU_12x12 (U13.D6), AUDIO (U20.30)
SAI2_SCKA: MPU_12x12 (SB3.1), AUDIO (U20.31)
SAI2_SDA: MPU_12x12 (SB2.1), AUDIO (U20.32)
SAI2_SDB: MPU_12x12 (SB4.1), AUDIO (U20.29)
SDMMC1_CK: MPU_12x12 (U13.D13), Peripherals (CN15.5 R19.1 U10.2 U10.9)
SDMMC1_CMD: MPU_12x12 (U13.D12), Peripherals (CN15.3 R25.1 U10.1 U10.10)
SDMMC1_D0: MPU_12x12 (U13.D18), Peripherals (CN15.7 R16.1 U26.4 U26.7)
SDMMC1_D1: MPU_12x12 (U13.D17), Peripherals (CN15.8 R14.1 U26.5 U26.6)
SDMMC1_D2: MPU_12x12 (U13.D15), Peripherals (CN15.1 R33.1 U26.1 U26.10)
SDMMC1_D3: MPU_12x12 (U13.D16), Peripherals (CN15.2 R28.1 U26.2 U26.9)
SDMMC2_CK: MPU_12x12 (U13.C9), WLAN_BLUETOOTH (TP25.1 U8.20)
SDMMC2_CMD: MPU_12x12 (U13.A10), WLAN_BLUETOOTH (R26.2 U8.22)
SDMMC2_D0: MPU_12x12 (U13.C13), WLAN_BLUETOOTH (R22.2 U8.24)
SDMMC2_D1: MPU_12x12 (U13.B12), WLAN_BLUETOOTH (R17.2 U8.26)
SDMMC2_D2: MPU_12x12 (U13.A11), WLAN_BLUETOOTH (R27.2 U8.23)
SDMMC2_D3: MPU_12x12 (U13.B13), WLAN_BLUETOOTH (R20.2 U8.25)
STLINK_SWCLK: MPU_12x12 (TP5.1 U13.B20), ST_LINK_V2-1 (SB20.2)
STLINK_SWDIO: MPU_12x12 (TP3.1 U13.C20), ST_LINK_V2-1 (SB17.2)
STUSB1600_IRQOUTn: MPU_12x12 (U13.P4), USB_Host_Hub&TypeC_DRP (U12.9)
UART4_RX: MPU_12x12 (U13.Y16), ST_LINK_V2-1 (R77.2)
UART4_TX: MPU_12x12 (U13.Y7), ST_LINK_V2-1 (R72.1)
USART2_CTS: MPU_12x12 (U13.D14), WLAN_BLUETOOTH (U8.5)
USART2_RTS: MPU_12x12 (U13.B6), WLAN_BLUETOOTH (U8.4)
USART2_RX: MPU_12x12 (U13.D2), WLAN_BLUETOOTH (TP27.1 U8.3)
USART2_TX: MPU_12x12 (U13.A7), WLAN_BLUETOOTH (TP28.1 U8.2)
USB1_N: MPU_12x12 (U13.AB17), USB_Host_Hub&TypeC_DRP (U7.30)
USB1_P: MPU_12x12 (U13.AC17), USB_Host_Hub&TypeC_DRP (U7.31)
USB2_N: MPU_12x12 (U13.AB16), USB_Host_Hub&TypeC_DRP (U29.2)
USB2_P: MPU_12x12 (U13.AC16), USB_Host_Hub&TypeC_DRP (U29.1)
USB_PWR_CC1: Power_PMIC (R49.2), MPU_12x12 (U13.V4)
USB_PWR_CC2: Power_PMIC (R56.2), MPU_12x12 (U13.V3)
uSD_DETECT: MPU_12x12 (U13.D11), Peripherals (R13.1)
WL_HOST_WAKE: MPU_12x12 (U13.B8), WLAN_BLUETOOTH (U8.27)
WL_REG_ON: MPU_12x12 (U13.B3), WLAN_BLUETOOTH (TP24.1 U8.28)

## Assembly variants
DK2: not fitted C8 C19 C24 C34 C87 C88 CN12 R9 R12 R32 R69 R73 R74 R78 R127 R134 R140 SB7 SB8 SB11 SB12 SB13 SB14 SB15 SB16 SB18 SB23 SB25
DK1: not fitted C8 C19 C24 C28 C29 C34 C37 C45 C87 C88 CN12 CN18 L1 L4 R9 R12 R17 R20 R22 R26 R27 R32 R69 R73 R74 R78 SB7 SB8 SB11 SB12 SB13 SB14 SB15 SB16 SB18 SB23 SB25 U8